# Altium schematic sheet ADC.SchDoc
size A4; SheetNumber: 6; SheetTotal: 7
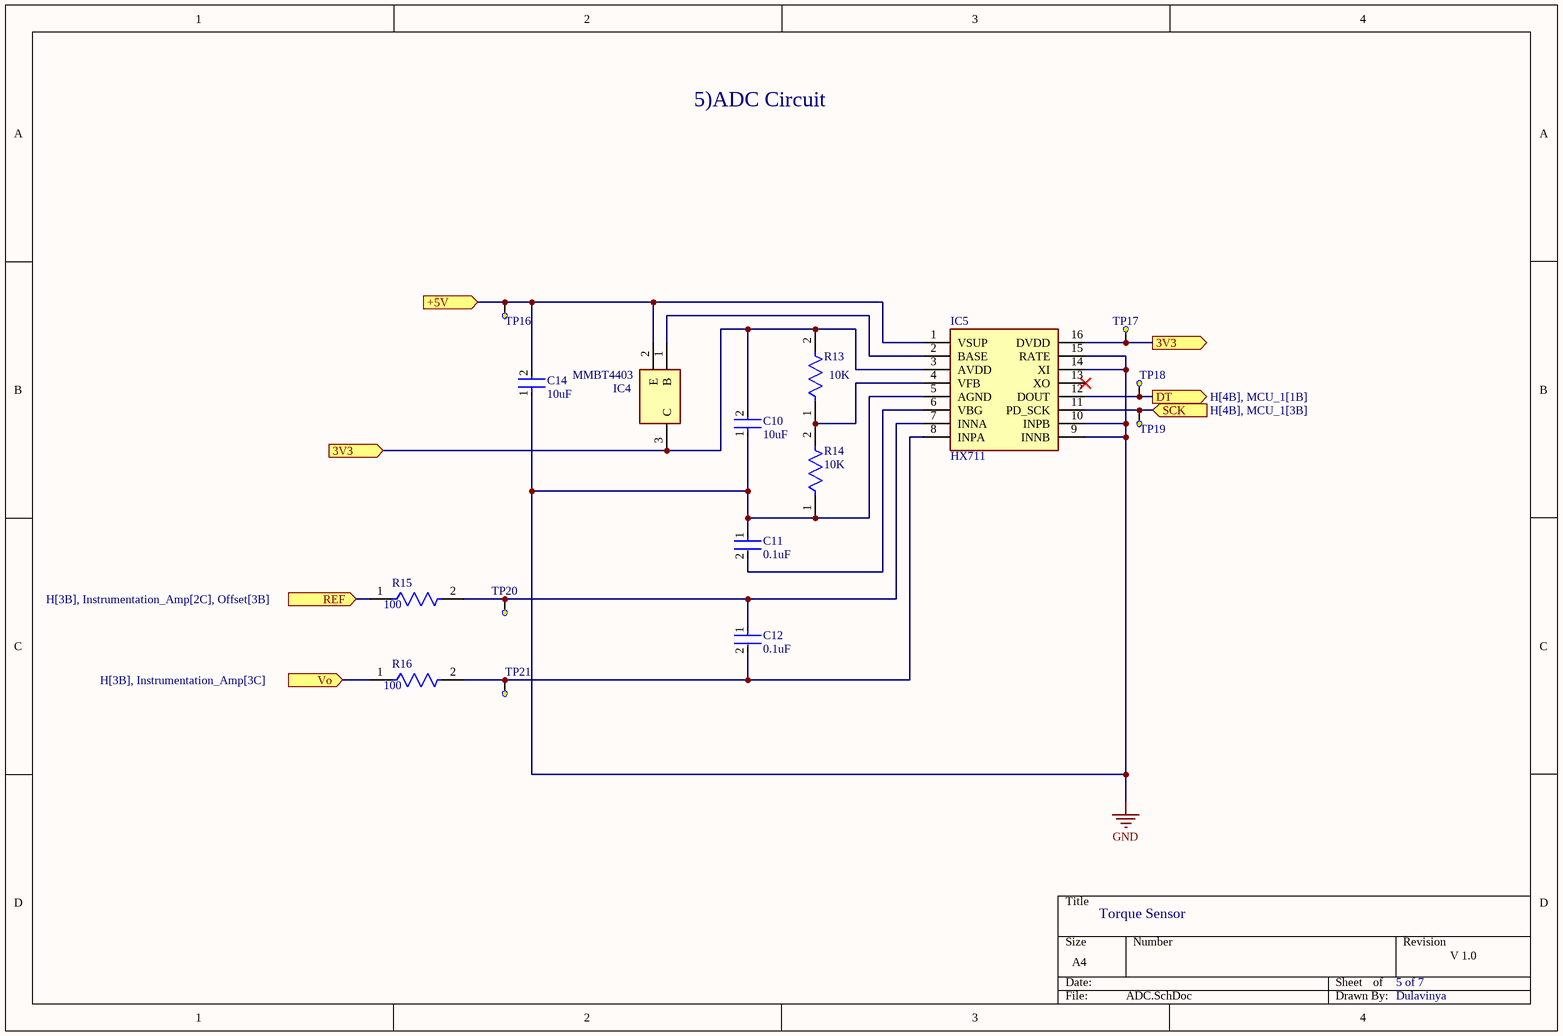
[diagram p0: ADC.SchDoc]

## Parts
C10  10uF  [FP-CL05A106MP5NUNC-MFG]
C11  0.1uF  [FP-C0402-BB-MFG]
C12  0.1uF  [FP-C0402-BB-MFG]
C14  10uF  [FP-CL05A106MP5NUNC-MFG]
IC4  MMBT4403  [SOT95P248X115-3N]
IC5  HX711  [SOIC127P600X160-16N]
R13  10K  [FP-ERJ2R-MFG]
R14  10K  [FP-ERJ2R-MFG]
R15  100  [FP-ERJ2R-MFG]
R16  100  [FP-ERJ2R-MFG]
TP16  Test point  [Test_point]  (value not drawn)
TP17  Test point  [Test_point]  (value not drawn)
TP18  Test point  [Test_point]  (value not drawn)
TP19  Test point  [Test_point]  (value not drawn)
TP20  Test point  [Test_point]  (value not drawn)
TP21  Test point  [Test_point]  (value not drawn)

## Ports
3V3 (in), 3V3 (out), +5V (in), DT (out, see H[4B], MCU_1[1B]), REF (in, see H[3B], Instrumentation_Amp[2C], Offset[3B]), SCK (in, see H[4B], MCU_1[3B]), Vo (in, see H[3B], Instrumentation_Amp[3C])

## Nets
GND: C10.1 C11.1 C14.1 IC5.5(AGND) IC5.9(INNB) IC5.10(INPB) IC5.14(XI) IC5.15(RATE) R14.1
3V3: C10.2 IC4.3(C) IC5.3(AVDD) IC5.16(DVDD) R13.2 TP17.TP?(Test_point) ; port 3V3
+5V: C14.2 IC4.2(E) IC5.1(VSUP) TP16.TP?(Test_point) ; port +5V
DT: IC5.12(DOUT) TP18.TP?(Test_point) ; port DT
REF: R15.1 ; port REF
SCK: IC5.11(PD_SCK) TP19.TP?(Test_point) ; port SCK
Vo: R16.1 ; port Vo
NetC11_2: C11.2 IC5.6(VBG)
NetC12_1: C12.1 IC5.7(INNA) R15.2 TP20.TP?(Test_point)
NetC12_2: C12.2 IC5.8(INPA) R16.2 TP21.TP?(Test_point)
NetIC4_1: IC4.1(B) IC5.2(BASE)
NetIC5_4: IC5.4(VFB) R13.1 R14.2

Not connected (* = marked no-connect by the designer): IC5 13(XO)*

## Notes on the sheet
- 5)ADC Circuit
- Torque Sensor
- 5 of 7
- V 1.0
- Dulavinya

## Library data of the parts
C10 C14 = CMP-13271-000002-1: CAP CER 10UF 10V X5R 0402; Manufacturer Part Number: CL05A106MP5NUNC; Manufacturer: Samsung; Temperature Coefficient: 15%; Tolerance: 20%; Material: Ceramic; Octopart: https://octopart.com/cl05a106mp5nunc-samsung-22457395; Voltage Rating: 10V; RoHS: TRUE; Value: 10uF; Height: 0.7mm; Digikey Description: CAP CER 10UF 10V X5R 0402; Automotive: No; Package: CL05A106MP5NUNC; Device Class L1: Passive Components; Capacitance: 10uF; Temperature Range High: +85°C; ComponentLink2Description: Datasheet; Device Class L2: Capacitors; Temperature Characteristic: X5R; Temperature: -55°C to +85°C; ComponentLink2URL: http://www.samsungsem.com/kr/support/product-search/mlcc/__icsFiles/afieldfile/2019/05/10/19-CL05A106MP5NUNC.pdf; Device Class L3: Ceramic Capacitors; Category: Cap; Temperature Range Low: -55°C; Ipc Land Pattern Name: CAPC10050X50; Lead Free: Yes
C11 C12 = CMP-2008-02108-2: CAP CER 0.1UF 16V X7R 0402; Manufacturer: Kemet; Manufacturer Part Number: C0402C104K4RACTU; Value: 0.10 μF; Tolerance: 0.1; Material: Ceramic; Temperature Coefficient: 15%; Voltage Rating: 16 V; Package: C0402-BB; Automotive: No; Ipc Land Pattern Name: CAPC10050X50; Device Class L3: Ceramic Capacitors; Capacitance: 0.10 μF; Octopart: https://octopart.com/c0402c104k4ractu-kemet-94158; Temperature Characteristic: X7R; Mouser Description: Cap Ceramic 0.1uF 16V X7R 10% SMD 0402 125?C Paper T/R - Tape and Reel (Alt: C0402C104K4RAC TU); ComponentLink2Description: Datasheet; Temperature Range Low: -55°C; RoHS: TRUE; Device Class L1: Passive Components; Temperature Range High: +125°C; Device Class L2: Capacitors; ComponentLink2URL: https://content.kemet.com/datasheets/KEM_C1002_X7R_SMD.pdf; Category: Cap; Height: 0.55mm; Temperature: -55°C to +125°C; Lead Free: Yes; Digikey Description: CAP CER 0.1UF 16V X7R 0402
IC4 = MMBT4403: Integrated Circuit; Manufacturer_Name: Diotec; Datasheet Link: https://diotec.com/request/datasheet/mmbt4403.pdf; Height: 1.15mm; Manufacturer_Part_Number: MMBT4403; Mouser Part Number: 637-MMBT4403; Mouser Price/Stock: https://www.mouser.co.uk/ProductDetail/Diotec-Semiconductor/MMBT4403?qs=OlC7AqGiEDl0uev6dumsfw%3D%3D; Arrow Part Number: MMBT4403; Arrow Price/Stock: https://www.arrow.com/en/products/mmbt4403/diotec-semiconductor-ag?utm_currency=USD&region=europe
IC5 = HX711: Integrated Circuit; Manufacturer_Name: AVIA; Datasheet Link: https://cdn.sparkfun.com/datasheets/Sensors/ForceFlex/hx711_english.pdf; Height: 1.6mm; Manufacturer_Part_Number: HX711
R13-R16 = CMP-2002-00694-4: RES SMD 15K OHM 1% 1/10W 0402; Manufacturer Part Number: ERJ-2RKF1502X; Manufacturer: Panasonic; Automotive Grade: Grade 0; Voltage Rating: 50V; Resistance: 15kΩ; Temperature Coefficient: 100ppm/°C; Power Rating: 0.1W; Value: 15kΩ; ComponentLink2URL: https://industrial.panasonic.com/cdbs/www-data/pdf/RDA0000/AOA0000C304.pdf; Automotive: Yes; Temperature: -55°C to +155°C; Height: 0.4mm; Digikey Description: RES SMD 15K OHM 1% 1/10W 0402; Category: Res; Device Class L2: Resistors; Device Class L1: Passive Components; Package: ERJ2R; Temperature Range Low: -55°C; Tolerance: 1%; Series: ERJ; Footprint Url: https://b2b-api.panasonic.eu/file_stream/pids/fileversion/1180; Mouser Description: Res Thick Film 1.0 x 0.5 mm 15K Ohm 1% 0.1W(1/10W) 100ppm/ C Molded SMD Punched Carrier T/R; Composition: Thick Film; Lead Free: Yes; Device Class L3: Chip SMD Resistors; Octopart: https://octopart.com/erj-2rkf1502x-panasonic-55404985; RoHS: TRUE; Temperature Range High: +155°C; ComponentLink2Description: Datasheet
TP16-TP21 = test_point: Value: Test point